# Altium schematic sheet SCH_Controller.SchDoc
size A4
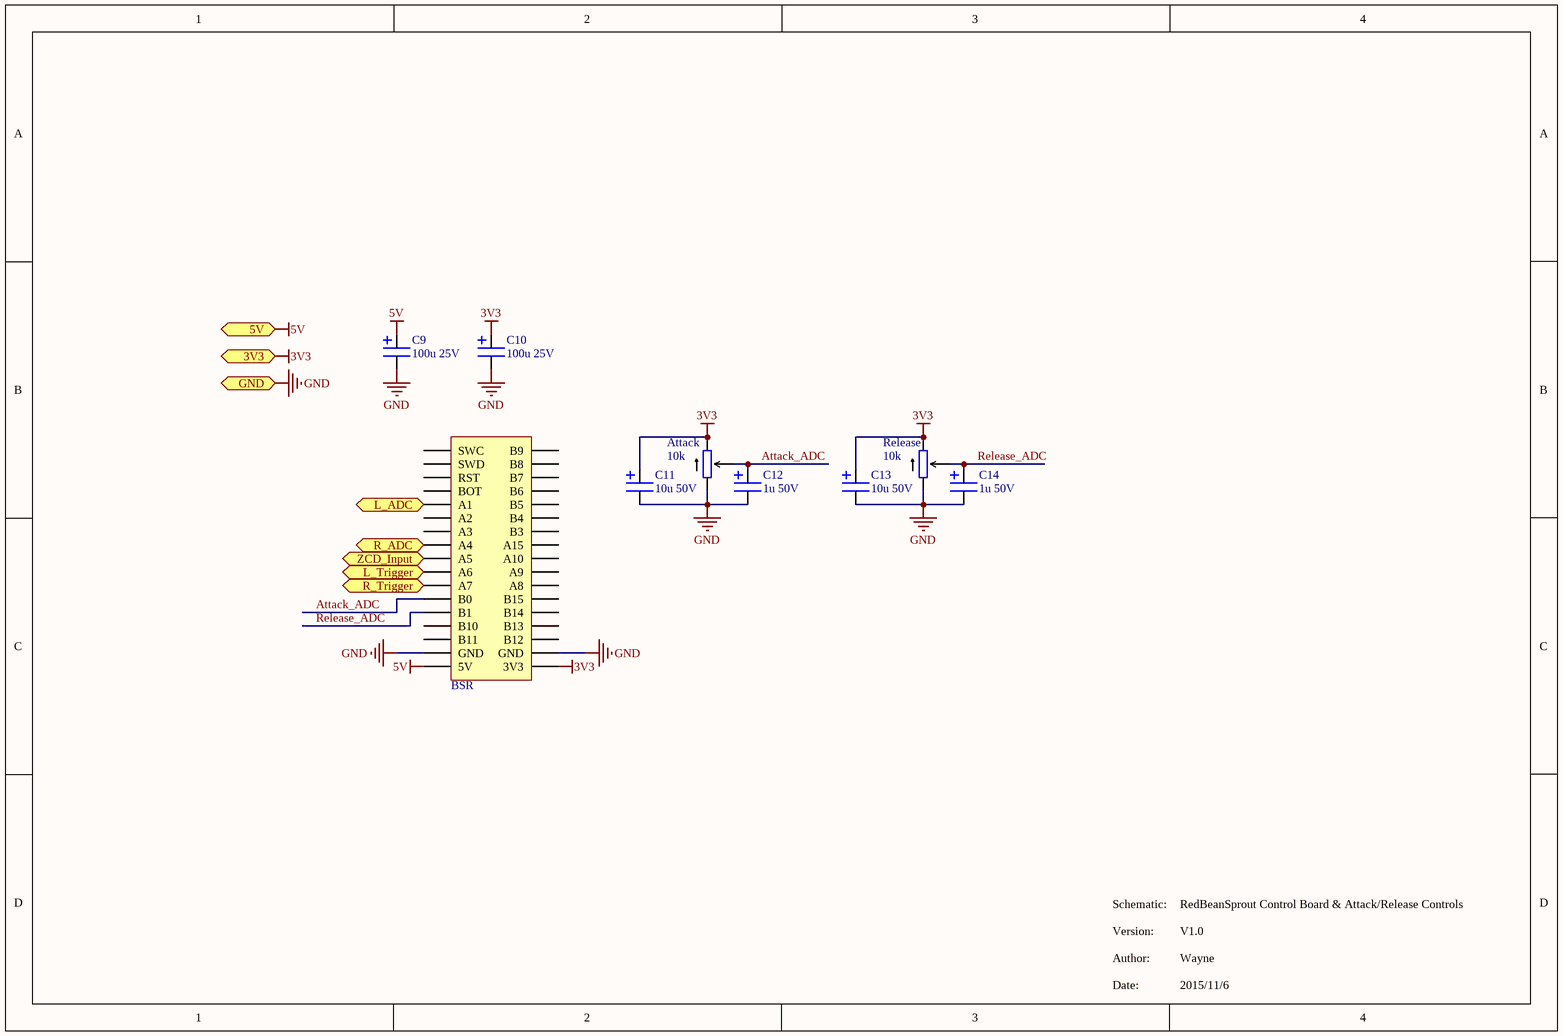
[diagram p0: SCH_Controller.SchDoc]

## Parts
Attack  value 10k  [POT RK09K1130AAU]  (hidden comment: Single POT)
BSR  BSR  [BSR]  (value not drawn)
C9  value 100u 25V  [CAP Axial 6.3mm]  (hidden comment: Cap)
C10  value 100u 25V  [CAP Axial 6.3mm]  (hidden comment: Cap)
C11  value 10u 50V  [CAP Axial 5mm]  (hidden comment: Cap)
C12  value 1u 50V  [CAP Axial 5mm]  (hidden comment: Cap)
C13  value 10u 50V  [CAP Axial 5mm]  (hidden comment: Cap)
C14  value 1u 50V  [CAP Axial 5mm]  (hidden comment: Cap)
Release  value 10k  [POT RK09K1130AAU]  (hidden comment: Single POT)

## Ports
3V3, 5V, GND, L_ADC, L_Trigger, R_ADC, R_Trigger, ZCD_Input

## Nets
3V3: Attack.3 BSR.18(3V3) C10.2 C11.2 C13.2 Release.3 ; port 3V3
5V: BSR.17(5V) C9.2 ; port 5V
GND: Attack.1 BSR.16(GND) BSR.19(GND) C9.1 C10.1 C11.1 C12.1 C13.1 C14.1 Release.1 ; port GND
Attack_ADC: Attack.2 BSR.12(B0) C12.2
L_ADC: BSR.5(A1) ; port L_ADC
L_Trigger: BSR.10(A6) ; port L_Trigger
R_ADC: BSR.8(A4) ; port R_ADC
R_Trigger: BSR.11(A7) ; port R_Trigger
Release_ADC: BSR.13(B1) C14.2 Release.2
ZCD_Input: BSR.9(A5) ; port ZCD_Input

Not connected (* = marked no-connect by the designer): BSR 1(SWC) 2(SWD) 3(RST) 4(BOT) 6(A2) 7(A3) 14(B10) 15(B11) 20(B12) 21(B13) 22(B14) 23(B15) 24(A8) 25(A9) 26(A10) 27(A15) 28(B3) 29(B4) 30(B5) 31(B6) 32(B7) 33(B8) 34(B9)

## Notes on the sheet
- RedBeanSprout Control Board & Attack/Release Controls
- Schematic:
  Version:
  Author:
  Date:
- Wayne
- V1.0
- 2015/11/6

## Library data of the parts
Attack Release = ALPS POT RK09K1130AAU
BSR = BSR: Bean Sprout Red Socket
C9-C14 = Axial Cap